# Altium project ECEN_404.PrjPcb
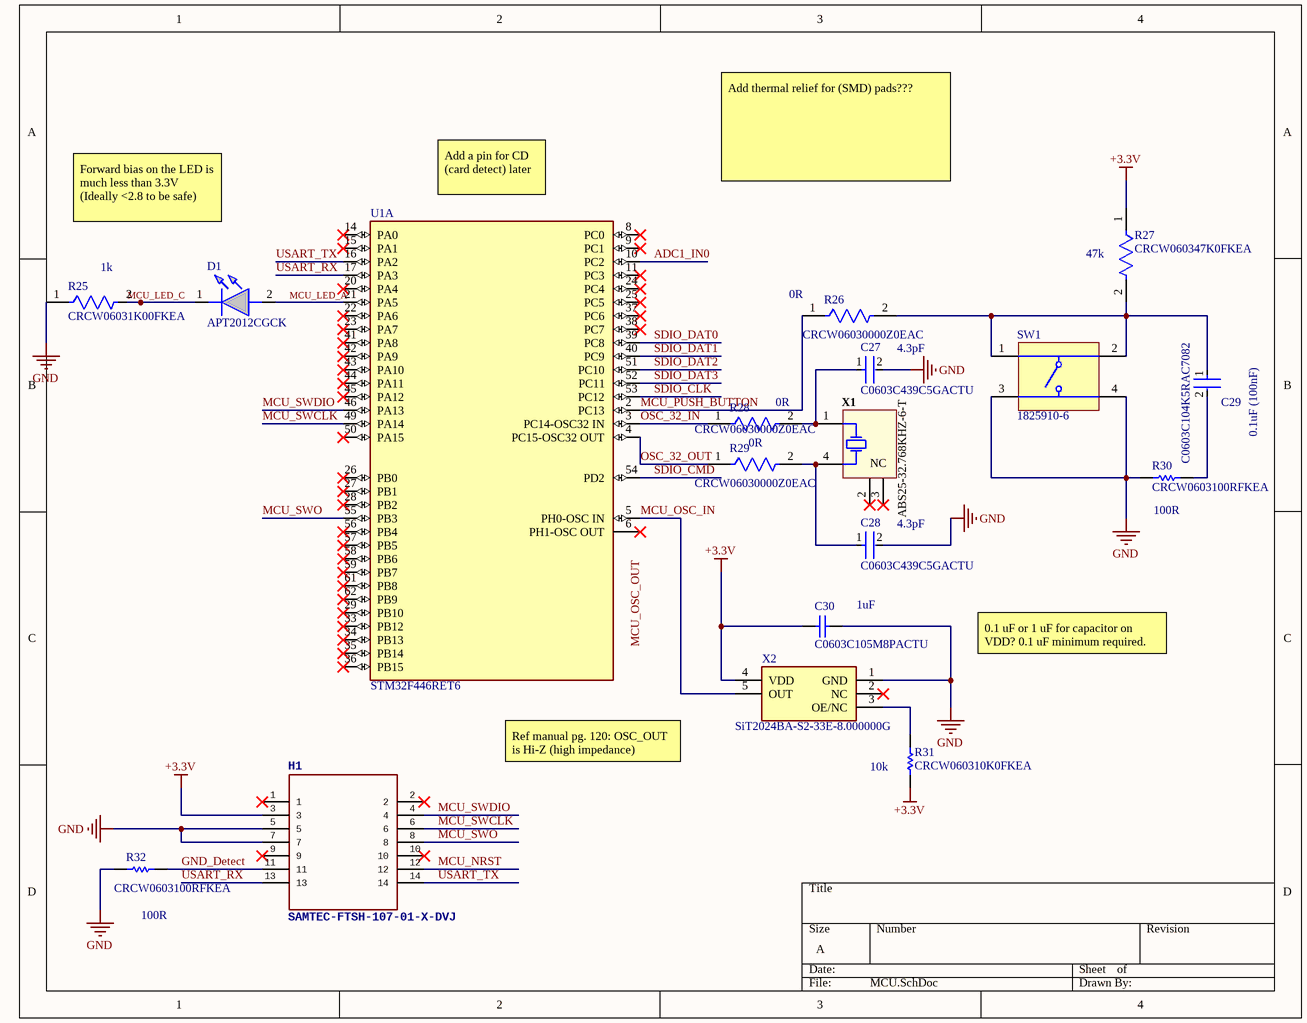
[diagram p0: MCU.SchDoc]
4 sheets, 72 parts. Net scope: global (net labels, ports and power ports of the same name join across sheets).
Board file: MCU_PCB_1.PcbDoc
Sheets:
  MCU.SchDoc
  microSD_reader.SchDoc
  power.SchDoc
  sensors.SchDoc

## Sheet MCU.SchDoc
size A; SheetNumber: 1; SheetTotal: 4

### Parts
C27  C0603C439C5GACTU  [FP-C0603C-CF-MFG]
C28  C0603C439C5GACTU  [FP-C0603C-CF-MFG]
C29  C0603C104K5RAC7082  [FP-C0603C-CF-MFG]
C30  C0603C105M8PACTU  [CAPC1608X90X35LL15T15]
D1  APT2012CGCK  [LEDC2012X50N]
H1  SAMTEC-FTSH-107-01-X-DVJ  [SAMTEC_FTSH-107-01-F-DV-K-P-TR]
R25  CRCW06031K00FKEA  [FP-CRCW0603-e3-MFG]
R26  CRCW06030000Z0EAC  [FP-CRCW0603-C-IPC_B]
R27  CRCW060347K0FKEA  [FP-CRCW0603-e3-IPC_B]
R28  CRCW06030000Z0EAC  [FP-CRCW0603-C-IPC_B]
R29  CRCW06030000Z0EAC  [FP-CRCW0603-C-IPC_B]
R30  CRCW0603100RFKEA  [RESC1609X50X30ML8T20]
R31  CRCW060310K0FKEA  [RESC1609X50X30NL8T20]
R32  CRCW0603100RFKEA  [RESC1609X50X30ML8T20]
SW1  1825910-6  [TECO-1825910-6_V]
U1  STM32F446RET6  [FP-LQFP64-5W-MFG]  (part A of 2)
X1  ABS25-32.768KHZ-6-T  [ABRA-ABS25-4_V]
X2  SiT2024BA-S2-33E-8.000000G  [SOT95P280X145-5N]

### Nets
+3.3V: C30.1 H1.3 R27.1 R31.2 X2.4(VDD)
GND: C27.2 C28.2 C30.2 H1.5 H1.7 R25.1 R30.2 R32.2 SW1.3 SW1.4 X2.1(GND)
ADC1_IN0: U1.10(PC2)
GND_Detect: H1.11 R32.1
MCU_LED_A: D1.2(A) U1.21(PA5)
MCU_LED_C: D1.1(K) R25.2
MCU_NRST: H1.12
MCU_OSC_IN: U1.5(PH0-OSC_IN) X2.5(OUT)
MCU_PUSH_BUTTON: R26.1 U1.2(PC13)
MCU_SWCLK: H1.6 U1.49(PA14)
MCU_SWDIO: H1.4 U1.46(PA13)
MCU_SWO: H1.8 U1.55(PB3)
OSC_32_IN: R28.1 U1.3(PC14-OSC32_IN)
OSC_32_OUT: R29.1 U1.4(PC15-OSC32_OUT)
SDIO_CLK: U1.53(PC12)
SDIO_CMD: U1.54(PD2)
SDIO_DAT0: U1.39(PC8)
SDIO_DAT1: U1.40(PC9)
SDIO_DAT2: U1.51(PC10)
SDIO_DAT3: U1.52(PC11)
USART_RX: H1.13 U1.17(PA3)
USART_TX: H1.14 U1.16(PA2)
NetC27_1: C27.1 R28.2 X1.1(X1)
NetC28_1: C28.1 R29.2 X1.4(X2)
NetC29_1: C29.1 R26.2 R27.2 SW1.1 SW1.2
NetC29_2: C29.2 R30.1
NetR31_1: R31.1 X2.3(OE/NC)

Not connected (* = marked no-connect by the designer): H1 1* 2* 9* 10*; U1 6(PH1-OSC_OUT)* 8(PC0)* 9(PC1)* 11(PC3)* 14(PA0)* 15(PA1)* 20(PA4)* 22(PA6)* 23(PA7)* 24(PC4)* 25(PC5)* 26(PB0)* 27(PB1)* 28(PB2)* 29(PB10)* 33(PB12)* 34(PB13)* 35(PB14)* 36(PB15)* 37(PC6)* 38(PC7)* 41(PA8)* 42(PA9)* 43(PA10)* 44(PA11)* 45(PA12)* 50(PA15)* 56(PB4)* 57(PB5)* 58(PB6)* 59(PB7)* 61(PB8)* 62(PB9)*; X1 2(NC)* 3(NC)*; X2 2(NC)*

### Notes on the sheet
- Forward bias on the LED is much less than 3.3V (Ideally <2.8 to be safe)
- (near U1) Add a pin for CD (card detect) later
- Add thermal relief for (SMD) pads???
- (near R25) 1k
- (near R26) 0R
- (near R27) 47k
- 4.3pF
- (near R28) 0R
- (near C29) 0.1uF (100nF)
- 0R
- (near C28) 4.3pF
- (near R30) 100R
- (near C30) 1uF
- 0.1 uF or 1 uF for capacitor on VDD? 0.1 uF minimum required.
- Ref manual pg. 120: OSC_OUT is Hi-Z (high impedance)
- (near R31) 10k
- (near R32) 100R
- Labels drawn without touching a wire or pin: MCU_OSC_OUT

### Library data of the parts
C27 C28 = CMP-1035-00305-3: CAP CER 4.3PF 50V NP0 0603; Manufacturer: KEMET; Automotive Grade: Grade 1; Tolerance: 0.25 pF; Material: Ceramic; Temperature Coefficient: 30ppm/°C; Temperature Characteristic: C0G; Voltage Rating: 50 V; Temperature Range High: +125°C; Temperature: -55°C to +125°C; Octopart: https://octopart.com/c0603c439c5gactu-kemet-8375741; Device Class L1: Passive Components; Package: C0603C-CF; RoHS: TRUE; ComponentLink2URL: https://api.kemet.com/component-edge/download/datasheet/C0603C100J5GACAUTO.pdf; ComponentLink2Description: Datasheet; Temperature Range Low: -55°C; Height: 0.87mm; Mouser Description: Capacitor, Ceramic, 4.3pF, 50VDC, .25-pF Tol, .25+pf Tol, C0G-TC Code, -30, 30ppm-TC; Lead Free: Yes; Capacitance: 4.3 pF; Category: Cap; Device Class L2: Capacitors; Manufacturer Part Number: C0603C439C5GACTU; Automotive: Yes; Digikey Description: CAP CER 4.3PF 50V NP0 0603; Device Class L3: Ceramic Capacitors; Value: 4.3 pF
C29 = CMP-03020-002411-2: C0603 0.10 μF X7R 30ppm/°C 10.00% 50 V; Manufacturer: KEMET; Voltage Rating: 50 V; Capacitance: 0.10 μF; Automotive Grade: Grade 1; Material: Ceramic; Value: 0.10 μF; Tolerance: 0.1; Automotive: Yes; Temperature Range Low: -55°C; Octopart: https://octopart.com/c0603c104k5rac7082-kemet-75146597; Temperature Coefficient: 30ppm/°C; ComponentLink2URL: https://api.kemet.com/component-edge/download/datasheet/C0603C100J5GACAUTO.pdf; RoHS: TRUE; ComponentLink2Description: Datasheet; Manufacturer Part Number: C0603C104K5RAC7082; Height: 0.87mm; Device Class L3: Ceramic Capacitors; Package: C0603C-CF; Temperature Characteristic: X7R; Device Class L2: Capacitors; Lead Free: Yes; Device Class L1: Passive Components; Temperature: -55°C to +125°C; Temperature Range High: +125°C; Category: Cap
C30 = CMP-2006-02271-1: Manufacturer: Kemet; Part Number: C0603C105M8PACTU
D1 = APT2012CGCK: Kingbright APT2012CGCK, APT2012 Series Green LED, 570 nm, 2012 (0805) Clear, Rectangle Lens SMD Package; Geometry.Height: 0.5mm; Mouser Part Number: 604-APT2012CGCK; Mouser Price/Stock: https://www.mouser.co.uk/ProductDetail/Kingbright/APT2012CGCK?qs=VdjlWU%2FzoOEv1TxC2gMNzg%3D%3D; Manufacturer_Name: Kingbright; Manufacturer_Part_Number: APT2012CGCK; Datasheet Link: https://componentsearchengine.com/Datasheets/1/APT2012CGCK.pdf
R25 = CMP-1666-00003-5: RES Thick Film, 1kΩ, 1%, 0.1W, 100ppm/°C, 0603; Max Power Dissipation: 100mW; Voltage Rating: 75V; Resistance: 1kR; Max Operating Temperature: 155°C; Number of Pins: 2; Case Code (Imperial): 0603; Width: 0.033inch; Power Rating: 100mW; Number of Terminations: 2; Package Quantity: 10; Weight: 7.1E-05oz; Tolerance: 1%; Temperature Coefficient: 100ppm/°C; Military Standard: Not; Mount: Surface Mount; Voltage Rating (DC): 75V; Depth: 0.85mm; Composition: Thick Film; Radiation Hardening: No; Termination: SMD/SMT; Length: 1.55mm; Case Code (Metric): 1608; Contact Plating: Tin; Min Operating Temperature: -55°C; Packaging: Tape and Reel; Height: 0.45mm; Lead Free: Lead Free; Case/Package: 0603; Features: Automotive AEC-Q200
R26 R28 R29 = CMP-02407-012292-2: RES 0 OHM JUMPER 1/10W 0603; Resistance: 22R; Power Rating: 100mW; Case/Package: Molded; Contact Plating: Tin; Resistor Type: Thick Film; Min Operating Temperature: -55°C; Termination: Wraparound; Max Operating Temperature: 155°C; Lead Free: Lead Free; Length: 1.55mm; RoHS Compliant: Yes; Mount: Surface Mount
R27 = CMP-2000-03379-3: RES SMD 47K OHM 1% 1/10W 0603; Voltage Rating: 75V; Max Power Dissipation: 100mW; Resistance: 47kR; Temperature Coefficient: 100ppm/°C; Size Code: 0603; Technology: THICK FILM; Case Code (Metric): 1608; Radiation Hardening: No; Case/Package: 0603; Number of Terminations: 2; Package Quantity: 5000; Width: 0.85mm; Series: CRCW; RoHS Compliant: Yes; Case Code (Imperial): 0603; Lead Free: Lead Free; Resistance Tolerance: 1%; Depth: 0.85mm; Contact Plating: Tin; Tolerance: 1%; Voltage Rating (DC): 75V; Min Operating Temperature: -55°C; Mount: Surface Mount; Packaging: Tape and Reel; Length: 1.55mm; Resistor Type: Thick Film; Features: Automotive AEC-Q200; Max Operating Temperature: 155°C; Weight: 7.1E-05oz; Construction: Rectangular; Height: 0.45mm; Military Standard: Not; Termination: SMD/SMT; Power Rating: 100mW
R30 R32 = CMP-2000-03824-5: Chip Resistor, 100 Ohm, +/- 1%, 100 mW,-55 to 155 degC, 0603 (1608 Metric), RoHS, Tape and Ree; Manufacturer: Vishay Semiconductor; ComponentLink2URL: http://www.vishay.com/docs/20035/dcrcwe3.pdf; ComponentLink1URL: http://www.vishay.com/; Mounting Technology: Surface Mount; ComponentLink1Description: Manufacturer URL; ComponentLink2Description: Datasheet; PackageDescription: 2-Pin Surface Mount Device, Body 1.575 x 0.85 mm; PackageReference: 0603; DatasheetVersion: 06/2012
R31 = CMP-1666-00005-4: Chip Resistor, 10 KOhm, +/- 1%, 100 mW, -55 to 155 degC, 0603 (1608 Metric), RoHS, Tape and Reel; Manufacturer: Vishay Semiconductor; Voltage Rating: 75 V; Max Operating Temperature: 155 degC; PackageDescription: 2-Pin Surface Mount Device, Body 1.575 x 0.85 mm; ComponentLink1Description: Manufacturer URL; RoHSCompliant: true; PackageReference: 0603; REACH SVHC: Unknown; Length: 1.55 mm; DatasheetVersion: 06/2012; Packaging: Tape and Reel; Min Operating Temperature: -55 degC; Mounting Technology: Surface Mount; ComponentLink2URL: https://datasheet.ciiva.com/11809/0900766b80d98afc-11809037.pdf; Height: 0.45 mm; ComponentLink2Description: Datasheet; Package Quantity: 5000; ComponentLink1URL: http://www.vishay.com/
SW1 = CMP-1684-00021-1: Tact Switch, SPST-NO, 0.05 A, -35 to 85 degC, 4-Pin THD, RoHS, Bulk; Manufacturer: TE Connectivity; Maximum Contact Resistance: 100mOhm; Mechanical Life: 100000Cycles; Bushing Type: Unthreaded; Switch Configuration: OFF(ON); Maximum DC Voltage Rating: 24V; Contact Rating @ Voltage: 0.05A@24VDC; Actuator Color: Black; Body Orientation: Straight; Function: MomentaryContact; Illumination: N/R; Actuator Style: RoundButton; Actuator Material: PolybutyleneTerephthalate; Dielectric Strength: 500VAC; Pole Throw Configuration: SPST; Actuator Length: 1.4mm; Product Weight: N/A; Contact Material: CopperAlloy; Housing Material: N/A; Terminal Type: PCPins; Minimum Insulation Resistance: 100MOhm; Package Description: 4-Pin Through Hole Device, Body 5.99 x 5.99 mm, Pitch 6.5 mm; Part No: 1825910-6; Package Reference: THD; Base Material: N/A; Manufacturer URL: http://www.te.com; Contact Plating: Silver; RoHS: Yes; Datasheet Version: Rev. C9; Electrical Life: 100000Cycles; Maximum AC Voltage Rating: N/A; Thread Size: N/R; Operating Temperature: -35to85C; Mounting: ThroughHole; Dimension: 5.99x5mm; Datasheet URL: http://www.te.com/commerce/DocumentDelivery/DDEController?Action=showdoc&DocId=Customer+Drawing%7F1825910%7FC9%7Fpdf%7FEnglish%7FENG_CD_1825910_C9.pdf%7F1825910-6; Family: 1825910; Seal Location: N/A; Seal Description: N/A; Packaging: N/A
U1 = CMP-12105-000007-1: IC MCU 32BIT 512KB FLASH 64LQFP; Manufacturer: ST; Number Of Spi Channels: 4; Ram Size: 128KBytes; Standoff Height: 0.05mm; Number Of Uart Channels: 6; Number Of Pwm Channels: 32; Max Junction Temp: +105°C; Number Of I/Os: 50; Number Of Usb Channels: 2; Frequency: 180MHz; Number Of A/D Converters: 3; Max Supply Voltage: 3.6V; Number Of Adc Channels: 16; Interface: I2C,SPI,UART,USART,CAN,USB,LIN,IrDA,I2S,Other; Memory Size: 512KBytes; Number Of Timers/Counters: 14; Min Supply Voltage: 1.7V; Core Architecture: ARM Cortex-M4; Data Bus Width: 32bits; Number Of Cores: 1; Ambient Temperature Range Low: -40°C; ComponentLink2URL: https://www.st.com/en/microcontrollers-microprocessors/stm32f446re.html; Category: IC; Height: 1.6mm; Ipc Land Pattern Name: QFP50P1200X1200X160-64; Manufacturer Part Number: STM32F446RET6; Octopart: https://octopart.com/stm32f446ret6-stmicroelectronics-52642920; Temperature Range High: +105°C; Lead Free: Yes; Mouser Description: ARM Microcontrollers - MCU High-performance and DSP with FP, ARM Cortex-M4 MCU with 512 Kbytes Flash, 180 MHz CPU, Art Accelerator, SDRAM; Digikey Description: IC MCU 32BIT 512KB FLASH 64LQFP; Ambient Temperature Range High: +85°C; Number Of I2C Channels: 4; Memory Type: FLASH; RoHS: TRUE; Automotive: No; Device Class L1: Integrated Circuits (ICs); Temperature: -40°C to +105°C; Device Class L2: Embedded Processors and Controllers; Device Class L3: Microcontrollers; Temperature Range Low: -40°C; Package: LQFP64-5W; ComponentLink2Description: Datasheet
X1 = CMP-2000-05036-1: Low Frequency Crystal, 32.768 KHz, 6 pF, +/- 20 ppm, -40 to 85 degC, 4-Pin SMD, RoHS, Tape and Reel; Manufacturer: Abracon; Tolerance: 20PPM; ESR: 50kOhms; Case Width: 3.8mm; Case Height: 2.5mm; Case Length: 8mm; Load Capacitance: 6pF; Operating Temperature Range: -40Cto+85C; Package Reference: ABS25; Factory Pack Quantity: 3000; Package Description: 4-Pin Surface Mount Device, Body 8 x 3.8 mm, Pitch 5.5 mm; Frequency: 32.768kHz; Termination Style: SMD/SMT; Manufacturer URL: http://www.abracon.com/; Type: LowFrequencyCrystal; Dimensions: 3.8mmWx8mmLx2.5mmH; Product Category: Crystals; Series: ABS25; RoHS: Details; Package / Case: 8mmx3.8mm; Datasheet Version: Jun-17; Brand: ABRACON; Datasheet URL: https://datasheet.ciiva.com/854/abs25-854528.pdf; Packaging: Reel; Mounting Style: SMD/SMT
X2 = SiT2024BA-S2-33E-8.000000G: Standard Clock Oscillators 8MHz 3.3V -40C +125C AEC-Q100; Manufacturer_Name: SiTime; Geometry.Height: 1.45mm; Mouser Part Number: 788-2024BA-S2-33E-8G; Mouser Price/Stock: https://www.mouser.com/Search/Refine.aspx?Keyword=788-2024BA-S2-33E-8G; Manufacturer_Part_Number: SiT2024BA-S2-33E-8.000000G; Datasheet Link: https://componentsearchengine.com/Datasheets/1/SiT2024BA-S2-33E-8.000000G.pdf

## Sheet microSD_reader.SchDoc
size A; SheetNumber: 2; SheetTotal: 4
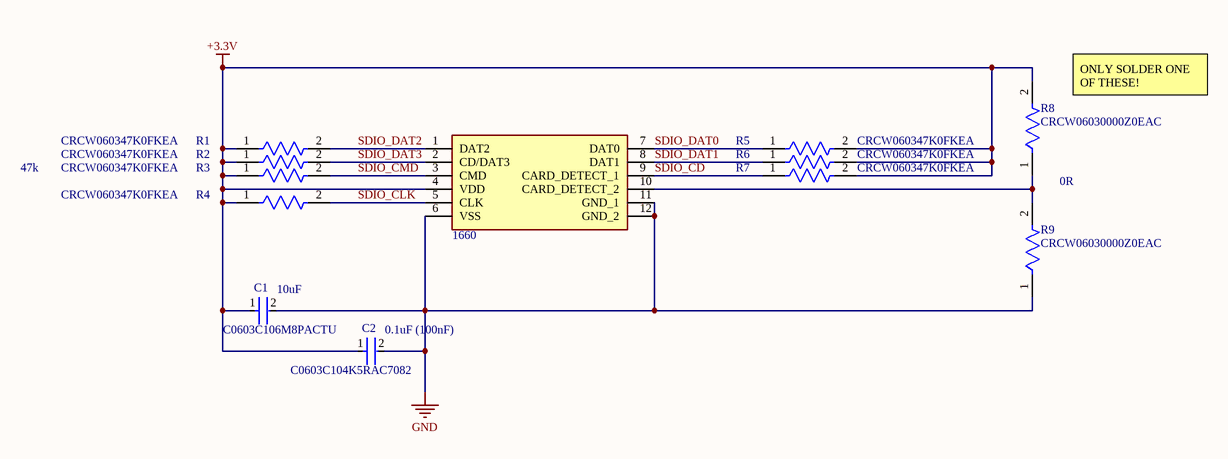
[diagram p1: microSD_reader.SchDoc]

### Parts
C1  C0603C106M8PACTU  [FP-C0603C106M8PACTU-MFG]
C2  C0603C104K5RAC7082  [FP-C0603C-CF-MFG]
J1  1660  [1660]
R1  CRCW060347K0FKEA  [FP-CRCW0603-e3-IPC_B]
R2  CRCW060347K0FKEA  [FP-CRCW0603-e3-IPC_B]
R3  CRCW060347K0FKEA  [FP-CRCW0603-e3-IPC_B]
R4  CRCW060347K0FKEA  [FP-CRCW0603-e3-IPC_B]
R5  CRCW060347K0FKEA  [FP-CRCW0603-e3-IPC_B]
R6  CRCW060347K0FKEA  [FP-CRCW0603-e3-IPC_B]
R7  CRCW060347K0FKEA  [FP-CRCW0603-e3-IPC_B]
R8  CRCW06030000Z0EAC  [FP-CRCW0603-C-IPC_B]
R9  CRCW06030000Z0EAC  [FP-CRCW0603-C-IPC_B]

### Nets
+3.3V: C1.1 C2.1 J1.4(VDD) R1.1 R2.1 R3.1 R4.1 R5.2 R6.2 R7.2 R8.2
GND: C1.2 C2.2 J1.6(VSS) J1.11(GND_1) J1.12(GND_2) R9.1
SDIO_CD: J1.9(CARD_DETECT_1) R7.1
SDIO_CLK: J1.5(CLK) R4.2
SDIO_CMD: J1.3(CMD) R3.2
SDIO_DAT0: J1.7(DAT0) R5.1
SDIO_DAT1: J1.8(DAT1) R6.1
SDIO_DAT2: J1.1(DAT2) R1.2
SDIO_DAT3: J1.2(CD/DAT3) R2.2
NetJ1_10: J1.10(CARD_DETECT_2) R8.1 R9.2

### Notes on the sheet
- (near R8) ONLY SOLDER ONE OF THESE!
- 47k
- 0R
- (near C1) 10uF
- (near C2) 0.1uF (100nF)

### Library data of the parts
C1 = CMP-03020-034654-1: CAP CER 10UF 10V X5R 0603; RoHS Compliant: Yes
C2 = CMP-03020-002411-2: as C29 on sheet MCU; Automotive: Yes; Temperature Range Low: -55°C; Octopart: https://octopart.com/c0603c104k5rac7082-kemet-75146597; Temperature Coefficient: 30ppm/°C; ComponentLink2URL: https://api.kemet.com/component-edge/download/datasheet/C0603C100J5GACAUTO.pdf; RoHS: TRUE; ComponentLink2Description: Datasheet; Manufacturer Part Number: C0603C104K5RAC7082; Height: 0.87mm; Device Class L3: Ceramic Capacitors; Package: C0603C-CF; Temperature Characteristic: X7R; Device Class L2: Capacitors; Lead Free: Yes; Device Class L1: Passive Components; Temperature: -55°C to +125°C; Temperature Range High: +125°C; Category: Cap
J1 = 1660: Adafruit Accessories MIcroSD Socket; Geometry.Height: 1mm; Mouser Part Number: 485-1660; Mouser Price/Stock: https://www.mouser.co.uk/ProductDetail/Adafruit/1660?qs=GURawfaeGuCXDyGMVdt6Kw%3D%3D; Manufacturer_Name: Adafruit; Manufacturer_Part_Number: 1660; Datasheet Link: https://cdn-shop.adafruit.com/datasheets/15882.pdf
R1-R7 = CMP-2000-03379-3: as R27 on sheet MCU; Size Code: 0603; Technology: THICK FILM; Case Code (Metric): 1608; Radiation Hardening: No; Case/Package: 0603; Number of Terminations: 2; Package Quantity: 5000; Width: 0.85mm; Series: CRCW; RoHS Compliant: Yes; Case Code (Imperial): 0603; Lead Free: Lead Free; Resistance Tolerance: 1%; Depth: 0.85mm; Contact Plating: Tin; Tolerance: 1%; Voltage Rating (DC): 75V; Min Operating Temperature: -55°C; Mount: Surface Mount; Packaging: Tape and Reel; Length: 1.55mm; Resistor Type: Thick Film; Features: Automotive AEC-Q200; Max Operating Temperature: 155°C; Weight: 7.1E-05oz; Construction: Rectangular; Height: 0.45mm; Military Standard: Not; Termination: SMD/SMT; Power Rating: 100mW
R8 R9 = CMP-02407-012292-2: as R26 on sheet MCU; Case/Package: Molded; Contact Plating: Tin; Resistor Type: Thick Film; Min Operating Temperature: -55°C; Termination: Wraparound; Max Operating Temperature: 155°C; Lead Free: Lead Free; Length: 1.55mm; RoHS Compliant: Yes; Mount: Surface Mount

## Sheet power.SchDoc
size A; SheetNumber: 3; SheetTotal: 4
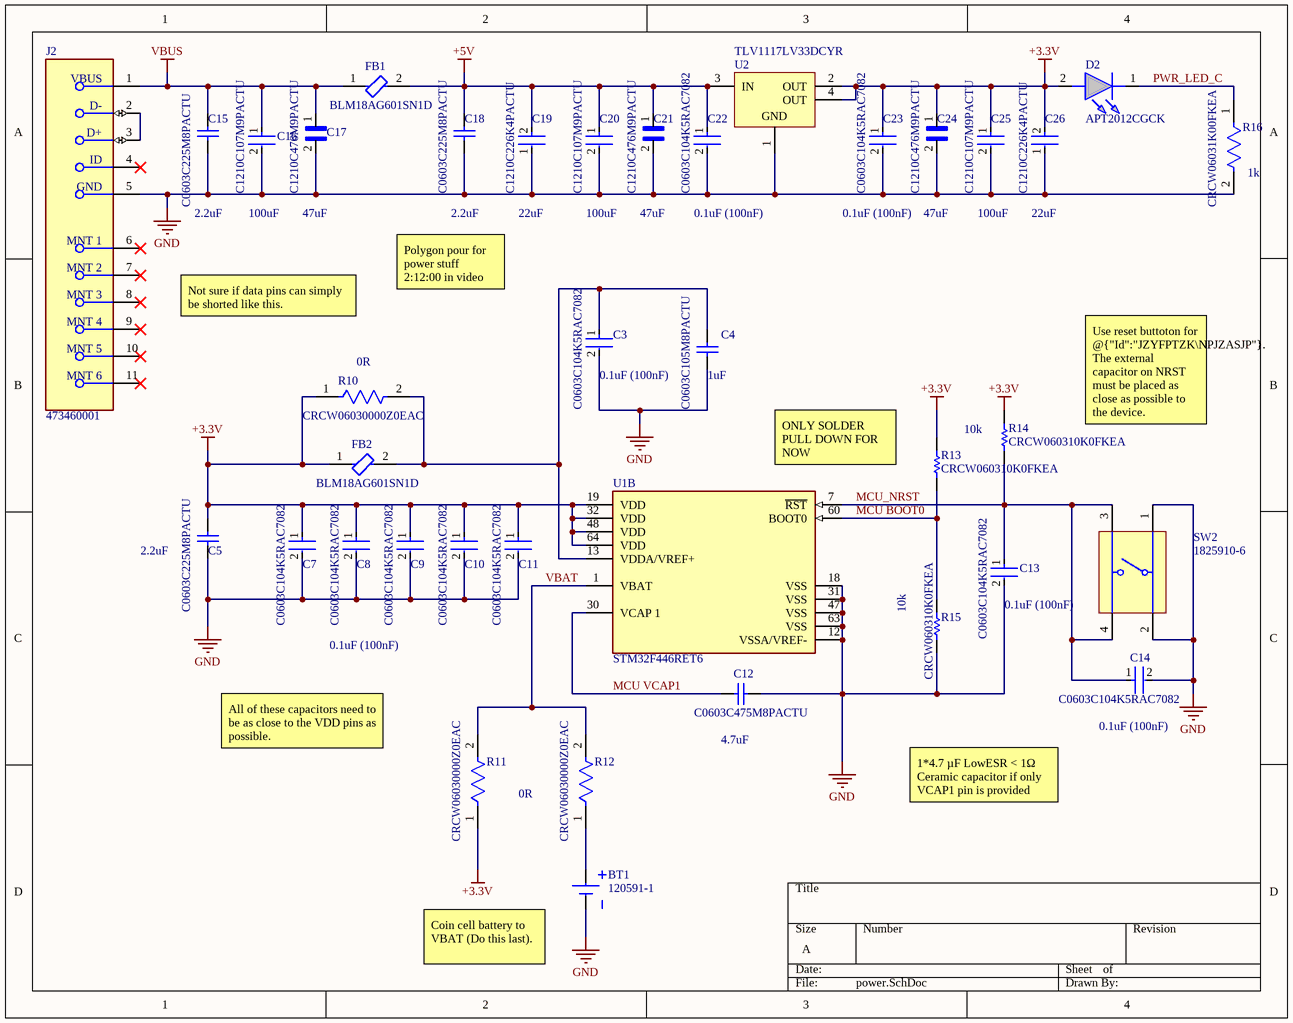
[diagram p2: power.SchDoc]

### Parts
BT1  120591-1  [TECO-120591-1-2_V]
C3  C0603C104K5RAC7082  [FP-C0603C-CF-MFG]
C4  C0603C105M8PACTU  [CAPC1608X90X35LL15T15]
C5  C0603C225M8PACTU  [CAPC1608X90X35LL15T15]
C7  C0603C104K5RAC7082  [FP-C0603C-CF-MFG]
C8  C0603C104K5RAC7082  [FP-C0603C-CF-MFG]
C9  C0603C104K5RAC7082  [FP-C0603C-CF-MFG]
C10  C0603C104K5RAC7082  [FP-C0603C-CF-MFG]
C11  C0603C104K5RAC7082  [FP-C0603C-CF-MFG]
C12  C0603C475M8PACTU  [CAPC1608X90X35ML15T15]
C13  C0603C104K5RAC7082  [FP-C0603C-CF-MFG]
C14  C0603C104K5RAC7082  [FP-C0603C-CF-MFG]
C15  C0603C225M8PACTU  [CAPC1608X90X35LL15T15]
C16  C1210C107M9PACTU  [FP-C1210C107M9PACTU-MFG]
C17  C1210C476M9PACTU  [CAPC3225X280]
C18  C0603C225M8PACTU  [CAPC1608X90X35LL15T15]
C19  C1210C226K4PACTU  [FP-C1210C226K4PACTU-MFG]
C20  C1210C107M9PACTU  [FP-C1210C107M9PACTU-MFG]
C21  C1210C476M9PACTU  [CAPC3225X280]
C22  C0603C104K5RAC7082  [FP-C0603C-CF-MFG]
C23  C0603C104K5RAC7082  [FP-C0603C-CF-MFG]
C24  C1210C476M9PACTU  [CAPC3225X280]
C25  C1210C107M9PACTU  [FP-C1210C107M9PACTU-MFG]
C26  C1210C226K4PACTU  [FP-C1210C226K4PACTU-MFG]
D2  APT2012CGCK  [LEDC2012X50N]
FB1  BLM18AG601SN1D  [FP-BLM18-0_15-t0_8-MFG]
FB2  BLM18AG601SN1D  [FP-BLM18-0_15-t0_8-MFG]
J2  473460001  [FP-473460001-MFG]
R10  CRCW06030000Z0EAC  [FP-CRCW0603-C-IPC_B]
R11  CRCW06030000Z0EAC  [FP-CRCW0603-C-IPC_B]
R12  CRCW06030000Z0EAC  [FP-CRCW0603-C-IPC_B]
R13  CRCW060310K0FKEA  [RESC1609X50X30NL8T20]
R14  CRCW060310K0FKEA  [RESC1609X50X30NL8T20]
R15  CRCW060310K0FKEA  [RESC1609X50X30NL8T20]
R16  CRCW06031K00FKEA  [FP-CRCW0603-e3-MFG]
SW2  1825910-6  [TECO-1825910-6_V]
U1  STM32F446RET6  [FP-LQFP64-5W-MFG]  (part B of 2)
U2  TLV1117LV33DCYR  [DCY0004A_N]

### Nets
+3.3V: C5.1 C7.1 C8.1 C9.1 C10.1 C11.1 C23.1 C24.1 C25.1 C26.2 D2.2(A) FB2.1 R10.1 R11.1 R13.2 R14.2 U1.19(VDD) U1.32(VDD) U1.48(VDD) U1.64(VDD) U2.2(OUT) U2.4(OUT)
+5V: C18.1 C19.2 C20.1 C21.1 C22.1 FB1.2 U2.3(IN)
GND: BT1.2(-) C3.2 C4.1 C5.2 C7.2 C8.2 C9.2 C10.2 C11.2 C12.2 C13.2 C14.2 C15.2 C16.2 C17.2 C18.2 C19.1 C20.2 C21.2 C22.2 C23.2 C24.2 C25.2 C26.1 J2.5(GND) R15.1 R16.2 SW2.1 SW2.2 U1.12(VSSA/VREF-) U1.18(VSS) U1.31(VSS) U1.47(VSS) U1.63(VSS) U2.1(GND)
VBUS: C15.1 C16.1 C17.1 FB1.1 J2.1(VBUS)
MCU BOOT0: R13.1 R15.2 U1.60(BOOT0)
MCU VCAP1: C12.1 U1.30(VCAP_1)
MCU_NRST: C13.1 C14.1 R14.1 SW2.3 SW2.4 U1.7(~{RST})
PWR_LED_C: D2.1(K) R16.1
VBAT: R11.2 R12.2 U1.1(VBAT)
NetBT1_1: BT1.1(+) R12.1
NetC3_1: C3.1 C4.2 FB2.2 R10.2 U1.13(VDDA/VREF+)
NetJ2_2: J2.2(D-) J2.3(D+)

Not connected (* = marked no-connect by the designer): J2 4(ID)* 6(MNT_1)* 7(MNT_2)* 8(MNT_3)* 9(MNT_4)* 10(MNT_5)* 11(MNT_6)*

### Notes on the sheet
- 2.2uF
- 100uF
- 47uF
- 22uF
- 0.1uF (100nF)
- (near R16) 1k
- Polygon pour for power stuff 2:12:00 in video
- Not sure if data pins can simply be shorted like this.
- (near R10) 0R
- (near C4) 1uF
- 10k
- Use reset buttoton for @{"Id":"JZYFPTZK\NPJZASJP"}.
  The external capacitor on NRST must be placed as close as possible to the device.
- ONLY SOLDER PULL DOWN FOR NOW
- (near C5) 2.2uF
- (near R15) 10k
- All of these capacitors need to be as close to the VDD pins as possible.
- (near C12) 4.7uF
- (near C14) 0.1uF (100nF)
- 0R
- 1*4.7 µF LowESR < 1Ω Ceramic capacitor if only VCAP1 pin is provided
- (near BT1) Coin cell battery to VBAT (Do this last).

### Library data of the parts
BT1 = CMP-0438-00001-2: Lithium Battery Holder for CR2032 3V Cell; Manufacturer: TE Connectivity; Packing Type: Tray; Body Shape: Horizontal Cylindrical; AccessRights: 2147483647; RevisionId: 1; Folder: Unified Components\Components\TE Connectivity\Connectors & Connector Components\Power Products\Battery Interconnection Products\; ContentType: Unified Component; ContentTypeGUID: CB3C11C4-E317-11DF-B822-12313F0024A2; ComponentLink1Description: Manufacturer URL; LifeCycleStateGUID: 61E382EE-6656-4F12-9E24-BE9327104A25; FolderGUID: A6761B51-D489-48A3-9180-F4808F45AB79; PartNumber: 120591-1; LifeCycle: Released; ReleaseDate: 20/08/2013 02:50:22 AM; PackageReference: 120591-1; ComponentLink2URL: http://www.te.com/commerce/DocumentDelivery/DDEController?Action=showdoc&DocId=Customer+Drawing%7F120591%7FH%7Fpdf%7FEnglish%7FENG_CD_120591_H.pdf%7F120591-1; DatasheetVersion: Rev. H, 01/2013; PackageDescription: Lithium Battery Holder; ItemGUID: B2C50140-681E-4F62-8DBB-9728605318CE; ItemHRID: CMP-0438-00001; Mounting Technology: Through Hole; ComponentLink1URL: http://www.te.com/; ComponentLink2Description: Datasheet
C3 C7-C11 C13 C14 C22 C23 = CMP-03020-002411-2: as C29 on sheet MCU; Automotive: Yes; Temperature Range Low: -55°C; Octopart: https://octopart.com/c0603c104k5rac7082-kemet-75146597; Temperature Coefficient: 30ppm/°C; ComponentLink2URL: https://api.kemet.com/component-edge/download/datasheet/C0603C100J5GACAUTO.pdf; RoHS: TRUE; ComponentLink2Description: Datasheet; Manufacturer Part Number: C0603C104K5RAC7082; Height: 0.87mm; Device Class L3: Ceramic Capacitors; Package: C0603C-CF; Temperature Characteristic: X7R; Device Class L2: Capacitors; Lead Free: Yes; Device Class L1: Passive Components; Temperature: -55°C to +125°C; Temperature Range High: +125°C; Category: Cap
C4 = CMP-2006-02271-1: Manufacturer: Kemet; Part Number: C0603C105M8PACTU
C5 C15 C18 = CMP-2006-02273-1: Manufacturer: Kemet; Part Number: C0603C225M8PACTU
C12 = CMP-2006-02263-1: Manufacturer: Kemet; Part Number: C0603C475M8PACTU
C16 C20 C25 = CMP-2000-06018-2: CAP CER 100UF 6.3V X5R 1210; Dissipation Factor: 5%; Dielectric Material: Ceramic; Tolerance: 20%; Termination: SMD/SMT; REACH SVHC: No SVHC; Thickness: 0.11inch; Packaging: Tape and Reel; Series: C; Width: 2.5mm; Voltage Rating (DC): 6.3V; Voltage: 6.3V; Contact Plating: Tin; Package Quantity: 1; Case/Package: 1210; Min Operating Temperature: -55°C; Height: 2.5mm; Radiation Hardening: No; Capacitance: 100uF; Case Code (Metric): 3225; Depth: 2.5mm; Construction: Flat; Max Operating Temperature: 85°C; Number of Pins: 2; Mount: Surface Mount; Lead Free: Lead Free; RoHS Compliant: Yes; Voltage Rating: 6.3V; Dielectric: X5R; Length: 3.2mm; Case Code (Imperial): 1210
C17 C21 C24 = C1210C476M9PACTU: CAP, MLCC, X5R, 47UF, 6.3V, 1210; Package: None; Price: None; Value: *; MP: C1210C476M9PACTU; Availability: Unavailable
C19 C26 = CMP-03020-034645-1: CAP CER 22UF 16V X5R 1210; Tolerance: 10%; Dielectric Material: Ceramic; Case Code (Metric): 3225; Mount: Surface Mount; Voltage: 16V; Construction: Flat; Lead Free: Lead Free; Radiation Hardening: No; Case Code (Imperial): 1210; Min Operating Temperature: -55°C; Height: 1.85mm; Termination: SMD/SMT; Voltage Rating (DC): 16V; Length: 3.2mm; Voltage Rating: 16V; Max Operating Temperature: 85°C; Packaging: Tape and Reel; RoHS Compliant: Yes; Capacitance: 22uF; Depth: 2.5mm; Case/Package: 1210; Dielectric: X5R
D2 = APT2012CGCK: as D1 on sheet MCU; Mouser Part Number: 604-APT2012CGCK; Mouser Price/Stock: https://www.mouser.co.uk/ProductDetail/Kingbright/APT2012CGCK?qs=VdjlWU%2FzoOEv1TxC2gMNzg%3D%3D; Manufacturer_Name: Kingbright; Manufacturer_Part_Number: APT2012CGCK; Datasheet Link: https://componentsearchengine.com/Datasheets/1/APT2012CGCK.pdf
FB1 FB2 = CMP-0686-00436-3: Chip Ferrite Bead, 0603, 600Ω @ 100MHz, 0.38Ω, 25%, 500mA; Number of Lines: 1; Impedance: 600R; DC Resistance (DCR): 380mR; Material: Steel; Shielding: Unshielded; Max DC Current: 500mA; Termination: SMD/SMT; Military Standard: Not; Number of Circuits: 1; Min Operating Temperature: -55°C; Case Code (Imperial): 0603; Width: 0.8mm; Current Rating: 500mA; Lead Free: Lead Free; Packaging: Tape and Reel; Frequency: 100MHz; Max Operating Temperature: 125°C; DC Current: 500mA; REACH SVHC: No SVHC; Case/Package: 0603; Package Quantity: 1; Height: 0.8mm; Number of Pins: 2; Depth: 0.8mm; Test Frequency: 100MHz; Case Code (Metric): 1608; Tolerance: 25%; Core Material: Ferrite; Weight: 7.1E-05oz; Max Current Rating: 500mA; Radiation Hardening: No; Length: 1.6mm; RoHS Compliant: Yes
J2 = CMP-2000-05246-2: CONN RCPT USB2.0 MICRO B SMD R/A; Manufacturer: Molex; Conn Orientation: Right Angle; Is Female: yes; Shielding: true; Pitch: 0.65mm; Number Of Contacts: 5; Voltage Rating: 30V; Current Rating: 1.8A; Device Class L2: USB Connectors; Digikey Description: CONN RCPT USB2.0 MICRO B SMD R/A; Height: 2.945mm; RoHS: TRUE; ComponentLink2Description: Datasheet; Octopart: https://octopart.com/47346-0001-molex-7164928; Automotive: No; Package: 0; Category: Conn; Device Class L1: Connectors; Usb Standard: USB 2.0; Temperature: -30°C to +85°C; Temperature Range Low: -30°C; Footprint Url: https://www.molex.com/pdm_docs/sd/473460001_sd.pdf; ComponentLink2URL: https://www.molex.com/webdocs/datasheets/pdf/en-us/0473460001_IO_CONNECTORS.pdf; Lead Free: Yes; Manufacturer Part Number: 473460001; Contact Material: Gold,Nickel; Temperature Range High: +85°C; Device Class L3: unset
R10-R12 = CMP-02407-012292-2: as R26 on sheet MCU; Case/Package: Molded; Contact Plating: Tin; Resistor Type: Thick Film; Min Operating Temperature: -55°C; Termination: Wraparound; Max Operating Temperature: 155°C; Lead Free: Lead Free; Length: 1.55mm; RoHS Compliant: Yes; Mount: Surface Mount
R13-R15 = CMP-1666-00005-4: as R31 on sheet MCU; Max Operating Temperature: 155 degC; PackageDescription: 2-Pin Surface Mount Device, Body 1.575 x 0.85 mm; ComponentLink1Description: Manufacturer URL; RoHSCompliant: true; PackageReference: 0603; REACH SVHC: Unknown; Length: 1.55 mm; DatasheetVersion: 06/2012; Packaging: Tape and Reel; Min Operating Temperature: -55 degC; Mounting Technology: Surface Mount; ComponentLink2URL: https://datasheet.ciiva.com/11809/0900766b80d98afc-11809037.pdf; Height: 0.45 mm; ComponentLink2Description: Datasheet; Package Quantity: 5000; ComponentLink1URL: http://www.vishay.com/
R16 = CMP-1666-00003-5: as R25 on sheet MCU; Max Operating Temperature: 155°C; Number of Pins: 2; Case Code (Imperial): 0603; Width: 0.033inch; Power Rating: 100mW; Number of Terminations: 2; Package Quantity: 10; Weight: 7.1E-05oz; Tolerance: 1%; Temperature Coefficient: 100ppm/°C; Military Standard: Not; Mount: Surface Mount; Voltage Rating (DC): 75V; Depth: 0.85mm; Composition: Thick Film; Radiation Hardening: No; Termination: SMD/SMT; Length: 1.55mm; Case Code (Metric): 1608; Contact Plating: Tin; Min Operating Temperature: -55°C; Packaging: Tape and Reel; Height: 0.45mm; Lead Free: Lead Free; Case/Package: 0603; Features: Automotive AEC-Q200
SW2 = CMP-1684-00021-1: as SW1 on sheet MCU; Product Weight: N/A; Contact Material: CopperAlloy; Housing Material: N/A; Terminal Type: PCPins; Minimum Insulation Resistance: 100MOhm; Package Description: 4-Pin Through Hole Device, Body 5.99 x 5.99 mm, Pitch 6.5 mm; Part No: 1825910-6; Package Reference: THD; Base Material: N/A; Manufacturer URL: http://www.te.com; Contact Plating: Silver; RoHS: Yes; Datasheet Version: Rev. C9; Electrical Life: 100000Cycles; Maximum AC Voltage Rating: N/A; Thread Size: N/R; Operating Temperature: -35to85C; Mounting: ThroughHole; Dimension: 5.99x5mm; Datasheet URL: http://www.te.com/commerce/DocumentDelivery/DDEController?Action=showdoc&DocId=Customer+Drawing%7F1825910%7FC9%7Fpdf%7FEnglish%7FENG_CD_1825910_C9.pdf%7F1825910-6; Family: 1825910; Seal Location: N/A; Seal Description: N/A; Packaging: N/A
U1 = CMP-12105-000007-1: as U1 on sheet MCU; Ambient Temperature Range Low: -40°C; ComponentLink2URL: https://www.st.com/en/microcontrollers-microprocessors/stm32f446re.html; Category: IC; Height: 1.6mm; Ipc Land Pattern Name: QFP50P1200X1200X160-64; Manufacturer Part Number: STM32F446RET6; Octopart: https://octopart.com/stm32f446ret6-stmicroelectronics-52642920; Temperature Range High: +105°C; Lead Free: Yes; Mouser Description: ARM Microcontrollers - MCU High-performance and DSP with FP, ARM Cortex-M4 MCU with 512 Kbytes Flash, 180 MHz CPU, Art Accelerator, SDRAM; Digikey Description: IC MCU 32BIT 512KB FLASH 64LQFP; Ambient Temperature Range High: +85°C; Number Of I2C Channels: 4; Memory Type: FLASH; RoHS: TRUE; Automotive: No; Device Class L1: Integrated Circuits (ICs); Temperature: -40°C to +105°C; Device Class L2: Embedded Processors and Controllers; Device Class L3: Microcontrollers; Temperature Range Low: -40°C; Package: LQFP64-5W; ComponentLink2Description: Datasheet
U2 = CMP-0395-00503-2: Single Output LDO, 1 A, Fixed 3.3 V Output, 2 to 5.5 V Input, 4-pin SOT-223 (DCY), -40 to 125 degC, Green (RoHS & no Sb/Br); Manufacturer: Texas Instruments; Vout Adj(Min)(V): 3.3; Vdo(Typ)(mV): 1200; Iq(Typ)(mA): 0.05; Accuracy(%): 2; Iout(Max)(A): 1; SubFamily: Single Channel LDO; Vin(Max)(V): 5.5; PackageReference: DCY0004A; PackageDescription: 4-Pin Plastic Small Outline, Body 3.5 x 6.5 mm, Pitch 2.3 mm; Vout Adj(Max)(V): 3.3; Mounting Technology: Surface Mount; ComponentLink2Description: Datasheet; ComponentLink1Description: Manufacturer URL; PartNumber: TLV1117LV33DCYR; ComponentLink3Description: Package Specification; ComponentLink1URL: http://www.ti.com/; ComponentLink2URL: http://www.ti.com/general/docs/lit/getliterature.tsp?genericPartNumber=TLV1117LV33&fileType=pdf; Fixed Output Options(V): 3.3; PackageVersion: 4202506/B; Vin(Min)(V): 2; DatasheetVersion: SBVS160A; Eco-Plan: Green (RoHS & no Sb/Br); ComponentLink3URL: http://www.ti.com/litv/pdf/mpds094a; Code_JEDEC: TO-261

## Sheet sensors.SchDoc
size A; SheetNumber: 4; SheetTotal: 4
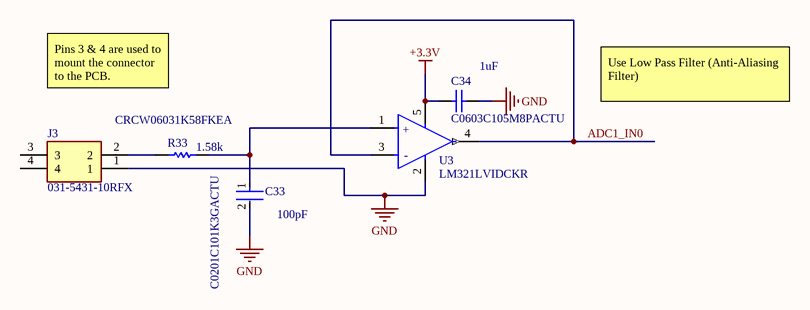
[diagram p3: sensors.SchDoc]

### Parts
C33  C0201C101K3GACTU  [FP-C0201-AB-MFG]
C34  C0603C105M8PACTU  [CAPC1608X90X35LL15T15]
J3  031-5431-10RFX  [031543110RFX]
R33  CRCW06031K58FKEA  [RESC1609X50X30NL10T20]
U3  LM321LVIDCKR  [FP-DCK0005A-IPC_B]

### Nets
+3.3V: C34.2 U3.5(V+)
GND: C33.2 C34.1 J3.1 U3.2(V-)
ADC1_IN0: U3.3(IN-) U3.4(OUT)
NetC33_1: C33.1 R33.2 U3.1(IN+)
NetJ3_2: J3.2 R33.1

Not connected (* = marked no-connect by the designer): J3 3 4

### Notes on the sheet
- (near C34) 1uF
- Pins 3 & 4 are used to mount the connector to the PCB.
- Use Low Pass Filter (Anti-Aliasing Filter)
- (near R33) 1.58k
- (near C33) 100pF
- (in symbol CMP-04895-000147-1) +; -

### Library data of the parts
C33 = CMP-03020-034480-1: CAP CER 100PF 25V 5% NP0 0201; Manufacturer: KEMET; Standoff Height: 0mm; Temperature Coefficient: 30ppm/°C; Tolerance: 0.1; Temperature Characteristic: C0G; Material: Ceramic; Value: 100 pF; Package: C0201-AB; Device Class L1: Passive Components; Device Class L3: Ceramic Capacitors; Automotive: No; Temperature Range Low: -55°C; Temperature Range High: +125°C; Octopart: https://octopart.com/c0201c101k3gactu-kemet-17054818; Ipc Land Pattern Name: CAPC6030X30; ComponentLink2URL: https://content.kemet.com/datasheets/KEM_C1003_C0G_SMD.pdf; Height: 0.33mm; Voltage Rating: 25 V; Lead Free: Yes; ComponentLink2Description: Datasheet; Digikey Description: CAP CER 100PF 25V 5% NP0 0201; Device Class L2: Capacitors; Capacitance: 100 pF; Temperature: -55°C to +125°C; Manufacturer Part Number: C0201C101K3GACTU; Mouser Description: Multilayer Ceramic Capacitors MLCC - SMD/SMT 25volts 100pF C0G 10%; Category: Cap; RoHS: TRUE
C34 = CMP-2006-02271-1: Manufacturer: Kemet; Part Number: C0603C105M8PACTU
J3 = 031-5431-10RFX: Amphenol BNC Series Right Angle 50 Through Hole BNC Connector, jack, Nickel, Solder Termination; Geometry.Height: 15.6mm; Mouser Part Number: 523-31-5431-10RFX; Mouser Price/Stock: https://www.mouser.co.uk/ProductDetail/Amphenol-RF/031-5431-10RFX?qs=py4qCovljJ8doXL0muNs1w%3D%3D; Manufacturer_Name: Amphenol; Manufacturer_Part_Number: 031-5431-10RFX; Datasheet Link: https://datasheet.datasheetarchive.com/originals/distributors/Datasheets-DGA15/760686.pdf
R33 = CMP-2000-02999-1: Manufacturer: Vishay Dale; Part Number: CRCW06031K58FKEA
U3 = CMP-04895-000147-1: IC OPAMP GP 1 CIRCUIT SC70-5; RoHS Compliant: Yes

## Nets that join several sheets
+3.3V: MCU (5 pins), microSD_reader (11 pins), power (22 pins), sensors (C34.2 U3.5)
GND: MCU (11 pins), microSD_reader (6 pins), power (35 pins), sensors (C33.2 C34.1 J3.1 U3.2)
ADC1_IN0: MCU (U1.10), sensors (U3.3 U3.4)
MCU_NRST: MCU (H1.12), power (6 pins)
SDIO_CLK: MCU (U1.53), microSD_reader (J1.5 R4.2)
SDIO_CMD: MCU (U1.54), microSD_reader (J1.3 R3.2)
SDIO_DAT0: MCU (U1.39), microSD_reader (J1.7 R5.1)
SDIO_DAT1: MCU (U1.40), microSD_reader (J1.8 R6.1)
SDIO_DAT2: MCU (U1.51), microSD_reader (J1.1 R1.2)
SDIO_DAT3: MCU (U1.52), microSD_reader (J1.2 R2.2)